# EAGLE design ELM327-based OBD-II interface (EAGLE 6.4)
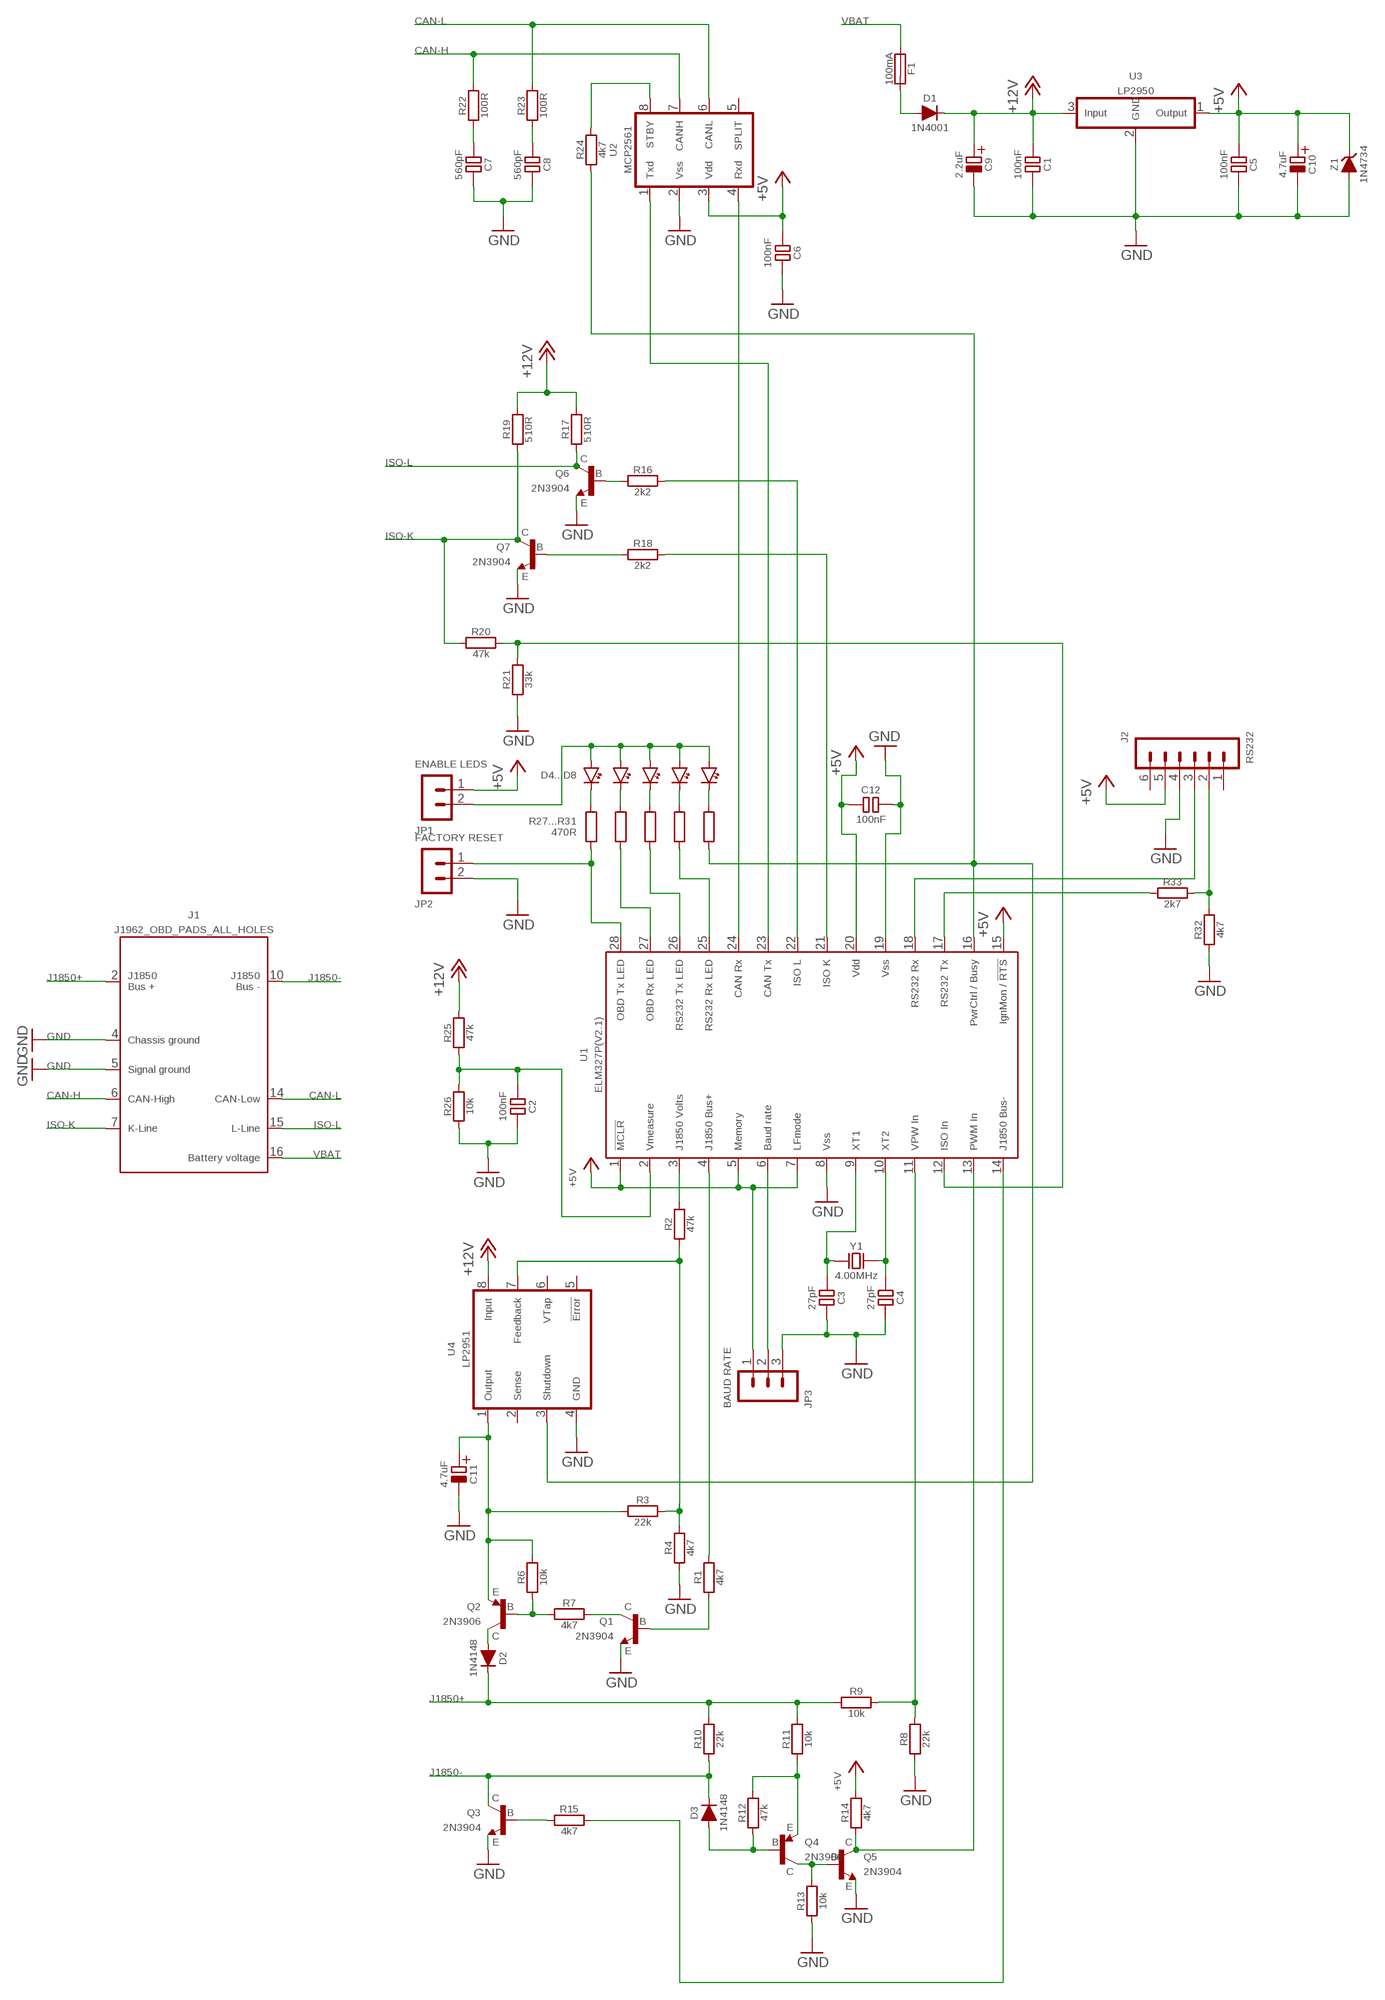
[diagram p0: schematic, sheet 1]

## Parts
C1  100nF  C(MLCC-5.08)  [MLCC-5.08]
C2  100nF  C(MLCC-5.08)  [MLCC-5.08]
C3  27pF  C(MLCC-5.08)  [MLCC-5.08]
C4  27pF  C(MLCC-5.08)  [MLCC-5.08]
C5  100nF  C(MLCC-5.08)  [MLCC-5.08]
C6  100nF  C(MLCC-5.08)  [MLCC-5.08]
C7  560pF  C(MLCC-5.08)  [MLCC-5.08]
C8  560pF  C(MLCC-5.08)  [MLCC-5.08]
C9  2.2uF  CPOL(E2-5)  [E2-5]
C10  4.7uF  CPOL(TANTALUM-5.08)  [TANTALUM-5.08]
C11  4.7uF  CPOL(TANTALUM-5.08)  [TANTALUM-5.08]
C12  100nF  C(MLCC-5.08)  [MLCC-5.08]
D1  1N4001  DIODE(DO-41)  [DO-41]
D2  1N4148  DIODE(DO-35)  [DO-35]
D3  1N4148  DIODE(DO-35)  [DO-35]
D4  OBD Tx  LED(5MM)  [LED_5MM]
D5  OBD Rx  LED(5MM)  [LED_5MM]
D6  RS232 Tx  LED(5MM)  [LED_5MM]
D7  RS232 Rx  LED(5MM)  [LED_5MM]
D8  ON  LED(5MM)  [LED_5MM]
F1  100mA  FUSE  [FUSE]
J1  J1962_OBD_PADS_ALL_HOLES  [J1962_OBD_PADS_ALL_HOLES]
J2  RS232  HEADER_1X6  [HEADER_1X6]
JP1  ENABLE LEDS  HEADER_1X2  [HEADER_1X2]
JP2  FACTORY RESET  HEADER_1X2  [HEADER_1X2]
JP3  BAUD RATE  HEADER_1X3  [HEADER_1X3]
Q1  2N3904  NPN(TO-92)  [TO-92]
Q2  2N3906  PNP(TO-92)  [TO-92]
Q3  2N3904  NPN(TO-92)  [TO-92]
Q4  2N3906  PNP(TO-92)  [TO-92]
Q5  2N3904  NPN(TO-92)  [TO-92]
Q6  2N3904  NPN(TO-92)  [TO-92]
Q7  2N3904  NPN(TO-92)  [TO-92]
R1  4k7  R-EU-MF12-1/8W  [MF12-1/8W]
R2  47k  R-EU-MF12-1/8W  [MF12-1/8W]
R3  22k  R-EU-MF12-1/8W  [MF12-1/8W]
R4  4k7  R-EU-MF12-1/8W  [MF12-1/8W]
R6  10k  R-EU-MF12-1/8W  [MF12-1/8W]
R7  4k7  R-EU-MF12-1/8W  [MF12-1/8W]
R8  22k  R-EU-MF12-1/8W  [MF12-1/8W]
R9  10k  R-EU-MF12-1/8W  [MF12-1/8W]
R10  22k  R-EU-MF12-1/8W  [MF12-1/8W]
R11  10k  R-EU-MF12-1/8W  [MF12-1/8W]
R12  47k  R-EU-MF12-1/8W  [MF12-1/8W]
R13  10k  R-EU-MF12-1/8W  [MF12-1/8W]
R14  4k7  R-EU-MF12-1/8W  [MF12-1/8W]
R15  4k7  R-EU-MF12-1/8W  [MF12-1/8W]
R16  2k2  R-EU-MF12-1/8W  [MF12-1/8W]
R17  510R  R-EU-MF50-1/2W  [MF50-1/2W]
R18  2k2  R-EU-MF12-1/8W  [MF12-1/8W]
R19  510R  R-EU-MF50-1/2W  [MF50-1/2W]
R20  47k  R-EU-MF12-1/8W  [MF12-1/8W]
R21  33k  R-EU-MF12-1/8W  [MF12-1/8W]
R22  100R  R-EU-MF12-1/8W  [MF12-1/8W]
R23  100R  R-EU-MF12-1/8W  [MF12-1/8W]
R24  4k7  R-EU-MF12-1/8W  [MF12-1/8W]
R25  47k  R-EU-MF12-1/8W  [MF12-1/8W]
R26  10k  R-EU-MF12-1/8W  [MF12-1/8W]
R27  470R  R-EU-MF12-1/8W  [MF12-1/8W]
R28  470R  R-EU-MF12-1/8W  [MF12-1/8W]
R29  470R  R-EU-MF12-1/8W  [MF12-1/8W]
R30  470R  R-EU-MF12-1/8W  [MF12-1/8W]
R31  470R  R-EU-MF12-1/8W  [MF12-1/8W]
R32  4k7  R-EU-MF12-1/8W  [MF12-1/8W]
R33  2k7  R-EU-MF12-1/8W  [MF12-1/8W]
U1  ELM327P(V2.1)  [SPDIP(28)]
U2  MCP2561  MCP2561FD(PDIP)  [PDIP]
U3  LP2950  LP2950ACZ-5.0  [TO-92]
U4  LP2951  LP2951ACN  [PDIP-8]
Y1  4.00MHz  HUS-4.000-18-30/50/-40+85  [HC49]
Z1  1N4734  ZENER(DO-41)  [DO-41]

## Nets
+5V: C5.+ C6.+ C10.+ C12.+ J2.5 JP1.1 JP3.1 R14.2 U1.1(!MCLR) U1.5(MEMORY) U1.7(LFMODE) U1.15(IGNMON/!RTS) U1.20(VDD) U2.3(VDD) U3.1(OUTPUT) Z1.C
+12V: C1.+ C9.+ D1.C R17.2 R19.2 R25.2 U3.3(INPUT) U4.8(INPUT)
CAN-H: J1.6 R22.2 U2.7(CANH)
CAN-L: J1.14 R23.2 U2.6(CANL)
GND: C1.- C2.- C3.- C4.- C5.- C6.- C7.- C8.- C9.- C10.- C11.- C12.- J1.4 J1.5 J2.4 JP2.2 JP3.3 Q1.E Q3.E Q5.E Q6.E Q7.E R4.1 R8.1 R13.1 R21.1 R26.1 R32.1 U1.8(VSS) U1.19(VSS) U2.2(VSS) U3.2(GND) U4.4(GND) Z1.A
ISO-K: J1.7 Q7.C R19.1 R20.1
ISO-L: J1.15 Q6.C R17.1
J1850+: D2.C J1.2 R9.1 R10.2 R11.2
J1850-: D3.C J1.10 Q3.C R10.1
N$1: D4.A D5.A D6.A D7.A D8.A JP1.2
N$2: JP2.1 R27.1 U1.28(OBD_TX_LED)
N$3: R28.1 U1.27(OBD_RX_LED)
N$4: R29.1 U1.26(RS232_TX_LED)
N$5: R30.1 U1.25(RS232_RX_LED)
N$6: D4.C R27.2
N$7: D5.C R28.2
N$8: D6.C R29.2
N$9: D7.C R30.2
N$10: D8.C R31.2
N$11: U1.24(CAN_RX) U2.4(RXD)
N$12: U1.23(CAN_TX) U2.1(TXD)
N$13: R24.1 R31.1 U1.16(PWRCTRL/BUSY) U4.3(SHUTDOWN)
N$14: C2.+ R25.1 R26.2 U1.2(VMEASURE)
N$15: R24.2 U2.8(STBY)
N$16: C7.+ R22.1
N$17: R2.2 U1.3(J1850_VOLTS)
N$18: C8.+ R23.1
N$19: Q7.B R18.1
N$20: Q6.B R16.1
N$21: R2.1 R3.2 R4.2 U4.7(FEEDBACK)
N$22: C11.+ Q2.E R3.1 R6.2 U4.1(OUTPUT)
N$23: Q2.B R6.1 R7.1
N$24: D2.A Q2.C
N$25: Q1.C R7.2
N$26: Q1.B R1.1
N$27: R1.2 U1.4(J1850_BUS+)
N$28: R18.2 U1.21(ISO_K)
N$29: C4.+ U1.10(XT2) Y1.2
N$30: C3.+ U1.9(XT1) Y1.1
N$31: R8.2 R9.2 U1.11(VPW_IN)
N$32: Q3.B R15.1
N$33: R15.2 U1.14(J1850_BUS-)
N$34: D3.A Q4.B R12.1
N$35: Q4.E R11.1 R12.2
N$36: Q4.C Q5.B R13.2
N$37: Q5.C R14.1 U1.13(PWM_IN)
N$38: R16.2 U1.22(ISO_L)
N$39: D1.A F1.2
N$40: R20.2 R21.2 U1.12(ISO_IN)
N$41: J2.3 U1.18(RS232_RX)
N$42: J2.2 R32.2 R33.2
N$43: R33.1 U1.17(RS232_TX)
N$44: JP3.2 U1.6(BAUD_RATE)
VBAT: F1.1 J1.16
Unconnected: J2.1 J2.6 U2.5(SPLIT) U4.2(SENSE) U4.5(ERROROUTPUT) U4.6(VOTAP)

## Notes on the sheet
- D4...D8
- R27...R31
  470R

## Library data of the parts
C1-C8 C12 = Capacitor:C
C9-C11 = Capacitor:CPOL
D1-D3 = diode:DIODE(?): Diode
D4-D8 = diode:LED(?)
F1 = fuse:FUSE
J1 = J1962:J1962_OBD_PADS_?
J2 = HEADERS:HEADER_1X6
JP1 JP2 = HEADERS:HEADER_1X2
JP3 = HEADERS:HEADER_1X3
Q1 Q3 Q5-Q7 = Transistor:NPN
Q2 Q4 = Transistor:PNP
R1-R4 R6-R33 = Resistor:R-EU-?
U1 = Elm Electronics:ELM327?(V2.1): ELM327 - OBD to RS232 Interpreter (v2.1) based on Microchip Technology Inc.'s PIC18F2480 (www.microchip.com) All versions of the ELM327 support the standard OBDII protocols. In addition, the IC supports various other protocols to varying degrees. Version 2.1 is the most recent revision. More info on Elm Electronics Inc. <www.elmelectronics.com>.
U2 = Microchip MCP2561:MCP2561FD(?): High-Speed CAN Flexible Data Rate Transceiver
U3 = ON Semiconductor LP2950, LP2951, NCV2951:LP2950*?; OUTPUT_VOLTAGE: 5.0 V; OUTPUT_VOLTAGE_PRECISION: 0.5%
U4 = ON Semiconductor LP2950, LP2951, NCV2951:LP2951*?; OUTPUT_VOLTAGE: 5.0 V or Adjustable; OUTPUT_VOLTAGE_PRECISION: 0.5%
Y1 = crystal:HUS-4.000-18-30/50/-40+85
Z1 = diode:ZENER(?)

## Net classes
0 default: width 0.5 mm, drill 0.5 mm, clearance 0.5 mm

## Board
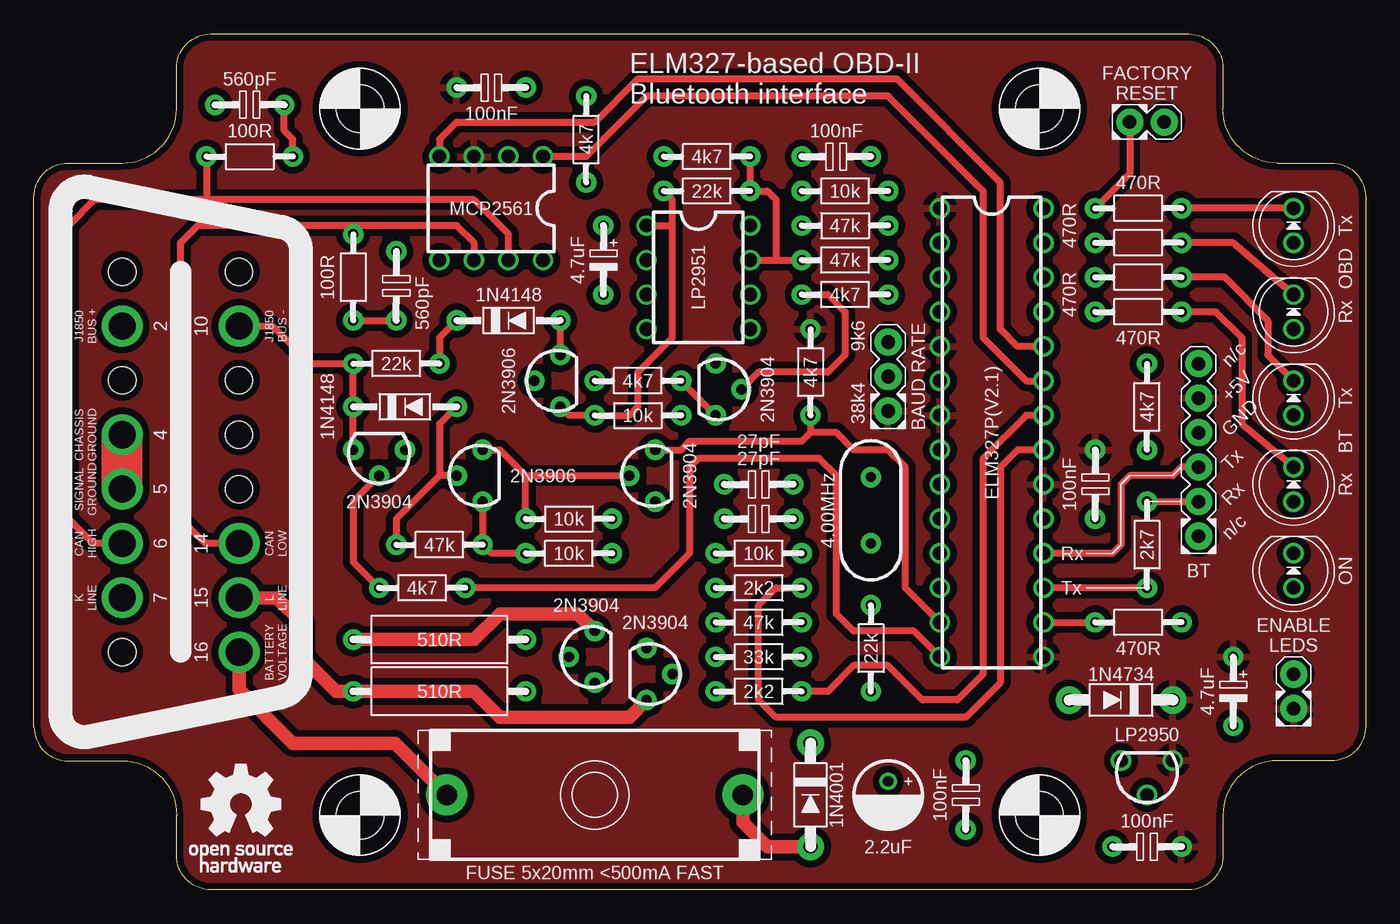
[diagram p1: board, top side]
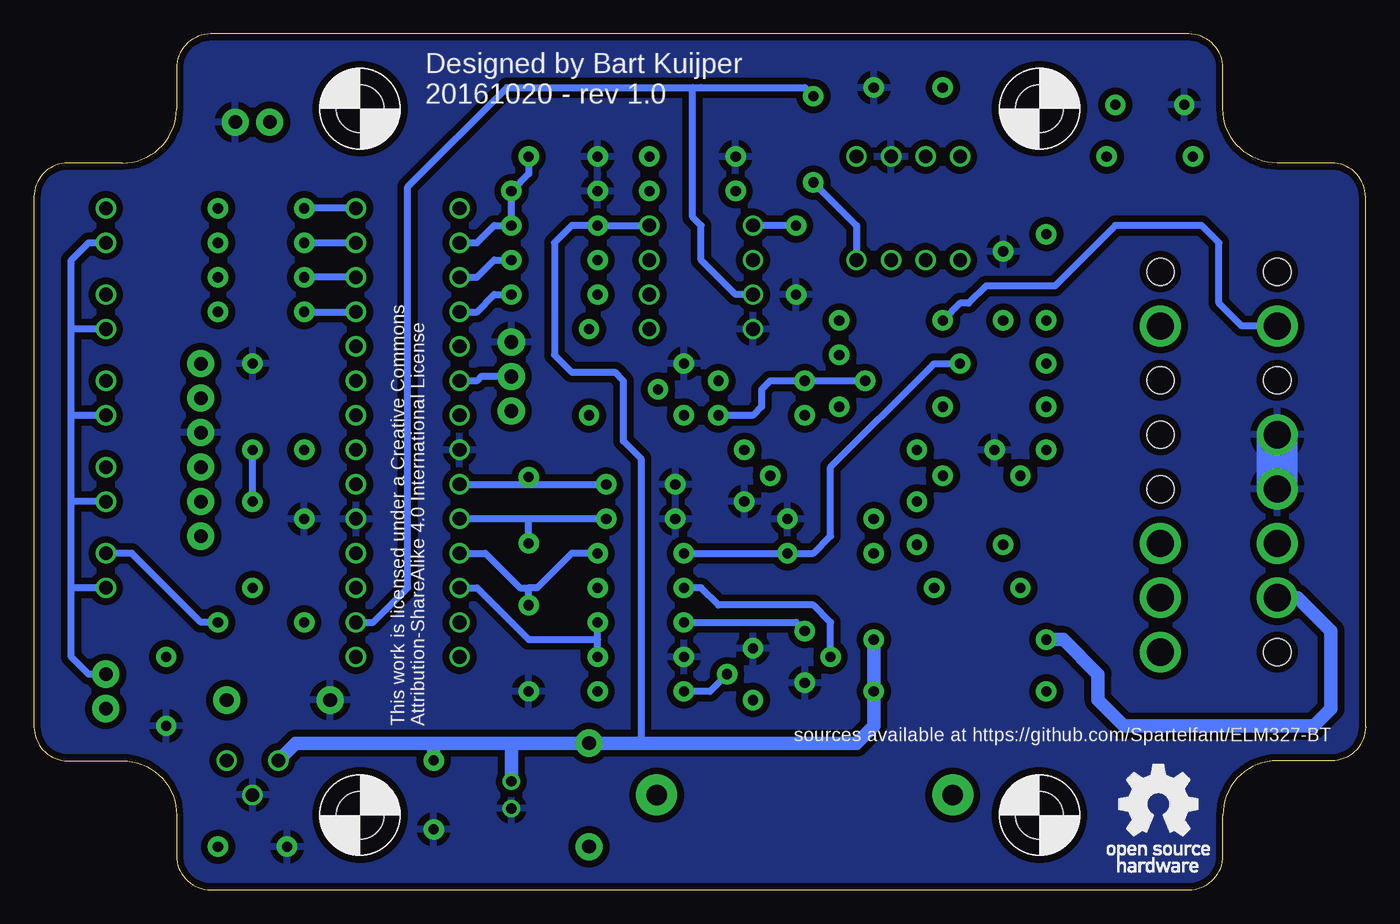
[diagram p2: board, bottom side, seen from below]

Size 98 x 63 mm. Coordinates in mm from the lower left corner, seen from the top.
Outline: 0,12 0,51 arc-90 2.5,53.5 6.5,53.5 arc90 10.5,57.5 10.5,60.5 arc-90 13,63 85,63 arc-90 87.5,60.5 87.5,57.5 arc90 91.5,53.5 95.5,53.5 arc-90 98,51 98,12 arc-90 95.5,9.5 91.5,9.5 arc90 87.5,5.5 87.5,2.5 arc-90 85,0 13,0 arc-90 10.5,2.5 10.5,5.5 arc90 6.5,9.5 2.5,9.5 arc-90 0,12
Copper layers (1*16): Top 0.035mm / dielectric 1.5mm / Bottom 0.035mm
Design rules "dirt_cheap_dirty_boards.v1 *": minimum track width 0.5mm, minimum drill 0.5mm, track to track 0.5mm, track to pad 0.5mm, pad to pad 0.5mm, via to via 0.5mm, smd to smd 0mil, copper to edge 0.5mm, drill to drill 0.5mm, minimum pad ring 0.25mm, minimum via ring 0.25mm, stop-mask expansion 0.05mm, vias tented up to drill 0mil, thermal gap 0.5mm
Holes 3.5 mm at 24,5.5 74,57.5 24,57.5 74,5.5
tRestrict: area 21,2.5 to 27,8.5; area 71,54.5 to 77,60.5; area 21,54.5 to 27,60.5; area 71,2.5 to 77,8.5
bRestrict: area 21,2.5 to 27,8.5; area 71,54.5 to 77,60.5; area 21,54.5 to 27,60.5; area 71,2.5 to 77,8.5

### Footprints (pad centres in the part's own frame; a part is rotated, then mirrored left to right if it is on the bottom)
MLCC-5.08 = drill 0.75 pad 1.5: + -2.54,0; - 2.54,0
E2-5 = drill 0.75 pad 1.27: + -1,0; - 1,0
TANTALUM-5.08 = drill 0.75 pad 1.5: + -2.54,0; - 2.54,0
DO-41 = drill 1 pad 2: A -3.81,0; C 3.81,0
DO-35 = drill 0.75 pad 1.5: A -3.81,0; C 3.81,0
LED_5MM = drill 1 pad 1.5: A -1.27,0; C 1.27,0
FUSE = drill 1.5 pad 3: 1 -10.9,0; 2 10.9,0
J1962_OBD_PADS_ALL_HOLES = drill 2 pad 3: 2 10,4.3; 4 2,4.3; 5 -2,4.3; 6 -6,4.3; 7 -10,4.3; 10 10,-4.3; 14 -6,-4.3; 15 -10,-4.3; 16 -14,-4.3 | hole 2: -14,4.3; 6,4.3; 6,-4.3; 2,-4.3; -2,-4.3; 14,-4.3; 14,4.3
HEADER_1X6 = drill 1 pad 2: 1 -6.35,0; 2 -3.81,0; 3 -1.27,0; 4 1.27,0; 5 3.81,0; 6 6.35,0
HEADER_1X2 = drill 1 pad 2: 1 -1.27,0; 2 1.27,0
HEADER_1X3 = drill 1 pad 2: 1 -2.54,0; 2 0,0; 3 2.54,0
TO-92 = drill 0.75 pad 1.5: B 0,1.27; C 1.905,-0.635; E -1.905,-0.635
MF12-1/8W = drill 0.75 pad 1.5: 1 -3.175,0; 2 3.175,0
MF50-1/2W = drill 0.75 pad 1.5: 1 -6.35,0; 2 6.35,0
SPDIP(28) = drill 1 pad 1.5: 1 -3.81,16.51; 2 -3.81,13.97; 3 -3.81,11.43; 4 -3.81,8.89; 5 -3.81,6.35; 6 -3.81,3.81; 7 -3.81,1.27; 8 -3.81,-1.27; 9 -3.81,-3.81; 10 -3.81,-6.35; 11 -3.81,-8.89; 12 -3.81,-11.43; 13 -3.81,-13.97; 14 -3.81,-16.51; 15 3.81,-16.51; 16 3.81,-13.97; 17 3.81,-11.43; 18 3.81,-8.89; 19 3.81,-6.35; 20 3.81,-3.81; 21 3.81,-1.27; 22 3.81,1.27; 23 3.81,3.81; 24 3.81,6.35; 25 3.81,8.89; 26 3.81,11.43; 27 3.81,13.97; 28 3.81,16.51
PDIP = drill 1 pad 1.5: 1 -3.81,3.81; 2 -3.81,1.27; 3 -3.81,-1.27; 4 -3.81,-3.81; 5 3.81,-3.81; 6 3.81,-1.27; 7 3.81,1.27; 8 3.81,3.81
TO-92' = drill 1 pad 1.5: 1 -1.905,-1.27; 2 0,1.27; 3 1.905,-1.27
PDIP-8 = drill 1 pad 1.5: 1 -3.81,3.81; 2 -3.81,1.27; 3 -3.81,-1.27; 4 -3.81,-3.81; 5 3.81,-3.81; 6 3.81,-1.27; 7 3.81,1.27; 8 3.81,3.81
HC49 = drill 0.75 pad 1.5: 1 -2.44,0; 2 2.44,0

### Placement (x,y rotation side)
C1  68.58,6.99 270 top
C2  59.05,53.98 180 top
C3  53.34,29.84 180 top
C4  53.34,27.3 180 top
C5  81.92,3.17 180 top
C6  33.66,59.05 0 top
C7  15.88,57.78 180 top
C8  26.67,44.45 90 top
C9  62.87,6.99 270 top
C10  88.27,14.61 270 top
C11  41.91,46.35 270 top
C12  78.11,29.84 270 top
D1  57.15,6.99 90 top
D2  34.92,41.91 180 top
D3  27.3,35.56 180 top
D4  92.71,48.9 90 top
D5  92.71,42.55 90 top
D6  92.71,36.2 90 top
D7  92.71,29.84 90 top
D8  92.71,23.5 90 top
F1  41.27,6.99 0 top
J1  10.79,31.5 90 top
J2  85.72,32.38 90 top
JP1  92.71,14.61 90 top
JP2  81.92,56.52 0 top
JP3  62.87,37.78 90 top
Q1  50.8,36.83 270 top
Q2  38.1,37.47 90 top
Q3  25.4,31.75 180 top
Q4  32.38,30.48 90 top
Q5  45.09,30.48 90 top
Q6  45.72,15.88 270 top
Q7  40.64,17.14 90 top
R1  59.69,43.81 0 top
R2  59.69,46.35 0 top
R3  49.53,51.44 0 top
R4  49.53,53.98 0 top
R6  44.45,34.92 180 top
R7  44.45,37.47 0 top
R8  61.59,17.78 90 top
R9  53.34,24.77 0 top
R10  26.67,38.73 0 top
R11  39.37,24.77 0 top
R12  29.84,25.4 0 top
R13  39.37,27.3 180 top
R14  57.15,38.1 90 top
R15  28.57,22.23 0 top
R16  53.34,14.61 0 top
R17  29.84,14.61 0 top
R18  53.34,22.23 0 top
R19  29.84,18.41 0 top
R20  53.34,19.68 0 top
R21  53.34,17.14 0 top
R22  15.88,53.98 180 top
R23  23.5,45.09 90 top
R24  40.64,55.24 270 top
R25  59.69,48.9 180 top
R26  59.69,51.44 0 top
R27  81.28,50.16 0 top
R28  81.28,47.62 0 top
R29  81.28,45.09 0 top
R30  81.28,42.55 0 top
R31  81.28,19.68 0 top
R32  81.92,35.56 270 top
R33  81.92,25.4 90 top
U1  70.48,33.66 0 top
U2  33.66,50.16 270 top
U3  LP2950  [TO-92']  81.92,8.26 180 top
U4  48.9,45.09 0 top
Y1  61.59,27.94 270 top
Z1  80.01,13.97 0 top

### Tracks (layer width: path | path; a pad name or v marks a point on that pad's centre or on a via)
+5V
  pour Top (isolate 0.5): 6.5,53.5 2.5,53.5 arc90 0,51 0,12 arc90 2.5,9.5 6.5,9.5 arc-90 10.5,5.5 10.5,2.5 arc90 13,0 85,0 arc90 87.5,2.5 87.5,5.5 arc-90 91.5,9.5 95.5,9.5 arc90 98,12 98,51 arc90 95.5,53.5 91.5,53.5 arc-90 87.5,57.5 87.5,60.5 arc90 85,63 13,63 arc90 10.5,60.5 10.5,57.5 arc-90
+12V
  Bottom 0.5: 53.34,10.79 53.34,31.75 54.61,33.02 54.61,37.47 55.24,38.1 58.42,38.1 59.69,39.37 59.69,47.62 58.42,48.9 R25.2 U4.8
  Bottom 1: R19.2 R17.2 36.2,12.06 37.47,10.79 53.34,10.79 D1.C 62.87,10.79 | 62.87,10.79 68.58,10.79 | 68.58,10.79 78.74,10.79 U3.3 | C1.+ 68.58,10.79 | C9.+ 62.87,10.79
CAN-H
  Top 0.5: U2.7 34.92,48.26 32.38,50.8 12.7,50.8 | J1.6 4.34,25.5 2.54,27.3 2.54,48.9 4.45,50.8 12.7,50.8 | R22.2 12.7,50.8
CAN-L
  Top 0.5: U2.6 32.38,47.62 31.11,48.9 23.5,48.9 | 23.5,48.9 12.06,48.9 10.79,47.62 10.79,27.3 12.6,25.5 J1.14 | R23.2 23.5,48.9
GND
  Top 3: J1.5 J1.4
  Bottom 3: J1.5 J1.4
  pour Bottom (isolate 0.5): 6.5,53.5 2.5,53.5 arc90 0,51 0,12 arc90 2.5,9.5 6.5,9.5 arc-90 10.5,5.5 10.5,2.5 arc90 13,0 85,0 arc90 87.5,2.5 87.5,5.5 arc-90 91.5,9.5 95.5,9.5 arc90 98,12 98,51 arc90 95.5,53.5 91.5,53.5 arc-90 87.5,57.5 87.5,60.5 arc90 85,63 13,63 arc90 10.5,60.5 10.5,57.5 arc-90
ISO-K
  Top 1: R19.1 32.38,18.41 34.29,20.32 40.01,20.32 Q7.C
  Bottom 0.5: R20.1 41.91,19.68 Q7.C
  Bottom 1: R19.1 22.23,18.41 19.68,15.88 19.68,13.97 17.78,12.06 3.81,12.06 2.54,13.34 2.54,19.05 4.99,21.5 J1.7
ISO-L
  Top 1: Q6.C 43.81,12.7 34.29,12.7 32.38,14.61 R17.1 22.23,14.61 19.68,17.14 19.68,19.68 17.87,21.5 J1.15
J1850+
  Top 0.5: D2.C 29.84,40.64 R10.2
  Bottom 0.5: R9.1 R11.2 40.64,24.77 39.37,26.04 39.37,31.11 32.07,38.42 | 32.07,38.42 31.75,38.73 | 31.75,38.73 R10.2 | 31.75,38.73 32.07,38.42 | J1.2 9.12,41.5 10.79,43.18 10.79,47.62 12.06,48.9 18.41,48.9 22.86,44.45 27.94,44.45 29.21,43.18 29.84,43.18 D2.C
J1850-
  Top 0.5: Q3.C D3.C R10.1 20.32,38.73 17.55,41.5 J1.10
N$1
  Bottom 0.5: JP1.2 93.98,15.88 95.25,17.14 95.25,22.23 | 95.25,22.23 95.25,28.57 | 95.25,28.57 95.25,34.92 | 95.25,34.92 95.25,41.27 | D5.A 95.25,41.27 | D6.A 95.25,34.92 | D7.A 95.25,28.57 | D8.A 95.25,22.23 | 95.25,41.27 95.25,46.35 93.98,47.62 D4.A
N$2
  Top 0.5: JP2.1 80.64,52.7 R27.1
  Bottom 0.5: U1.28 R27.1
N$3
  Bottom 0.5: R28.1 U1.27
N$4
  Bottom 0.5: U1.26 R29.1
N$5
  Bottom 0.5: R30.1 U1.25
N$6
  Top 0.5: D4.C R27.2
N$7
  Top 0.5: D5.C 88.27,47.62 R28.2
N$8
  Top 0.5: R29.2 87.63,45.09 90.81,41.91 90.81,39.37 D6.C
N$9
  Top 0.5: R30.2 87,42.55 88.9,40.64 88.9,34.29 D7.C
N$10
  Bottom 0.5: R31.2 85.72,19.68 90.81,24.77 D8.C
N$11
  Top 0.5: U1.24 72.39,40.01 71.12,41.27 71.12,52.07 63.5,59.69 44.45,59.69 41.27,56.52 31.11,56.52 29.84,55.24 U2.4
N$12
  Top 0.5: U1.23 73.03,37.47 69.85,40.64 69.85,51.44 62.87,58.42 45.09,58.42 40.64,53.98 U2.1
N$13
  Top 0.5: U1.16 R31.1
  Bottom 0.5: U1.16 73.03,19.68 70.48,22.23 70.48,51.75 63.18,59.05 49.53,59.05 | R24.1 41.27,59.05 48.9,59.05 49.53,59.05 | U4.3 46.35,43.81 48.9,46.35 48.9,48.9 49.53,49.53 49.53,59.05
N$14
  Bottom 0.5: U1.2 65.41,47.62 64.14,48.9 R25.1 R26.2 61.59,52.7 C2.+
N$15
  Bottom 0.5: R24.2 37.47,48.9 U2.8
N$16
  Top 0.5: R22.1 19.05,55.24 18.41,55.88 C7.+
N$17
  Bottom 0.5: U1.3 65.41,45.09 64.14,46.35 R2.2
N$18
  Top 0.5: R23.1 C8.+
N$19
  Bottom 0.5: Q7.B 39.37,19.68 40.64,20.95 47.62,20.95 48.9,22.23 R18.1
N$20
  Bottom 0.5: Q6.B 48.26,14.61 R16.1
N$21
  Top 0.5: U4.7 54.61,46.35 | 54.61,46.35 R2.1 | 54.61,46.35 54.61,50.8 53.98,51.44 R3.2 R4.2
N$22
  Top 0.5: 46.99,48.9 46.99,40.64 44.45,38.1 44.45,35.56 43.81,34.92 R6.2 39.37,34.92 Q2.E | 46.99,48.9 46.99,50.8 R3.1 | U4.1 46.99,48.9
  Bottom 0.5: C11.+ U4.1
N$23
  Bottom 0.5: R6.1 45.09,34.92 44.45,35.56 44.45,36.83 43.81,37.47 R7.1 Q2.B
N$24
  Top 0.5: D2.A Q2.C
N$25
  Top 0.5: Q1.C R7.2
N$26
  Top 0.5: R1.1 58.42,43.81 59.69,42.55 59.69,39.37 58.42,38.1 53.34,38.1 Q1.B
N$27
  Bottom 0.5: U1.4 65.41,42.55 64.14,43.81 R1.2
N$28
  Top 0.5: U1.21 72.39,32.38 71.12,31.11 71.12,15.24 68.58,12.7 54.61,12.7 53.34,13.97 53.34,20.95 54.61,22.23 R18.2
N$29
  Bottom 0.5: C4.+ 61.59,27.3 | 61.59,27.3 U1.10 | Y1.2 61.59,27.3
N$30
  Bottom 0.5: U1.9 61.59,29.84 | 61.59,29.84 C3.+ | Y1.1 61.59,29.84
N$31
  Bottom 0.5: U1.11 64.77,24.77 62.23,22.23 61.59,22.23 | R8.2 61.59,22.23 | R9.2 58.42,24.77 60.96,22.23 61.59,22.23
N$32
  Top 0.5: Q3.B 23.5,28.57 23.5,24.13 R15.1
N$33
  Top 0.5: U1.14 64.77,19.05 60.33,19.05 59.05,20.32 59.05,30.48 57.78,31.75 48.9,31.75 48.26,31.11 48.26,24.77 45.72,22.23 R15.2
N$34
  Top 0.5: Q4.B 29.84,30.48 | 29.84,30.48 26.67,27.3 R12.1 | D3.A 29.84,34.29 29.84,30.48
N$35
  Top 0.5: Q4.E R12.2 33.66,24.77 R11.1
N$36
  Top 0.5: Q4.C 34.29,32.38 36.2,30.48 | 36.2,30.48 Q5.B | R13.2 36.2,30.48
N$37
  Top 0.5: U1.13 64.14,22.23 64.14,31.11 62.87,32.38 60.33,32.38 59.05,33.66 57.15,33.66 | R14.1 57.15,33.66 | Q5.C 47.62,32.38 48.26,33.02 56.52,33.02 57.15,33.66
N$38
  Top 0.5: U1.22 73.03,34.92 69.85,31.75 69.85,15.88 67.94,13.97 65.41,13.97 62.87,16.51 60.33,16.51 58.42,14.61 R16.2
N$39
  Top 1: F1.2 52.17,4.97 53.98,3.17 D1.A
N$40
  Bottom 0.5: U1.12 65.41,22.23 61.59,18.41 56.52,18.41 | R21.2 56.52,18.41 | 56.52,18.41 R20.2
N$41
  Top 0.5: J2.3 84.45,31.11 83.82,30.48 80.64,30.48 80.01,29.84 80.01,25.4 79.38,24.77 U1.18
N$42
  Top 0.5: R33.2 J2.2
  Bottom 0.5: R33.2 R32.2
N$43
  Top 0.5: R33.1 U1.17
N$44
  Bottom 0.5: JP3.2 65.09,37.78 65.41,37.47 U1.6
VBAT
  Top 1: J1.16 15.1,14.75 19.05,10.79 26.57,10.79 F1.1

### Text on the board
tNames: ELM327-based OBD-II / Bluetooth interface | FACTORY / RESET | Tx | OBD | Rx | 9k6 | n/c | +5V | Tx | 38k4 | GND | BT | Tx | Rx | Rx | n/c | Rx | BT | Tx | ENABLE / LEDS | FUSE 5x20mm <500mA FAST
bNames: Designed by Bart Kuijper / 20161020 - rev 1.0 | This work is licensed under a Creative Commons / Attribution-ShareAlike 4.0 International License | sources available at https://github.com/Spartelfant/ELM327-BT